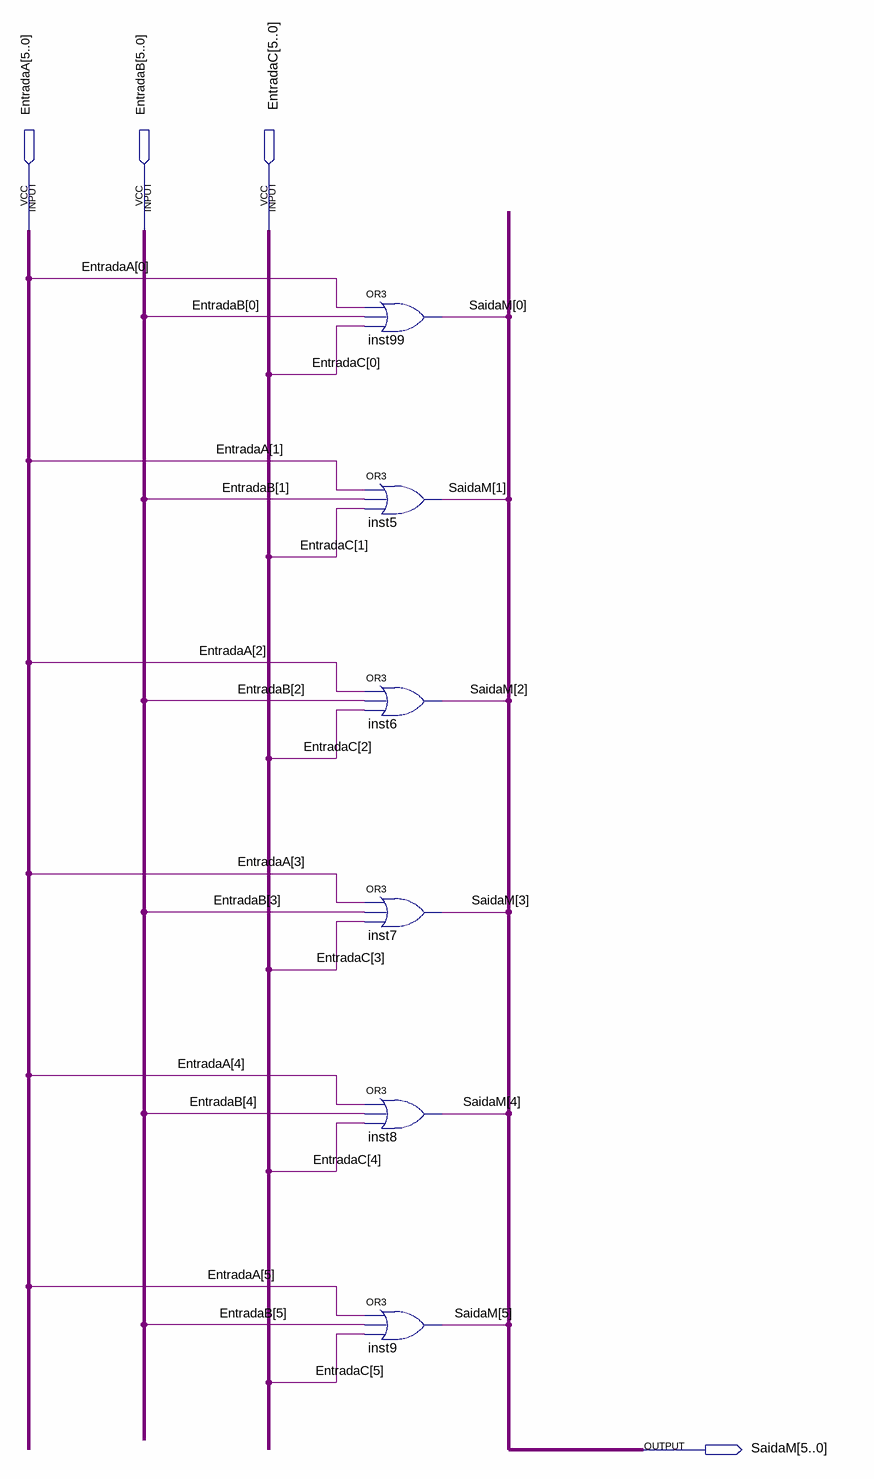
[diagram p0: schematic sheet]
// Quartus schematic Mux.bdf as structural Verilog: 6 symbols, 4 pins
module Mux (
  input  [5:0] EntradaA,
  input  [5:0] EntradaB,
  input  [5:0] EntradaC,
  output [5:0] SaidaM
);

  or inst99 (SaidaM[0], EntradaA[0], EntradaB[0], EntradaC[0]);
  or inst5 (SaidaM[1], EntradaA[1], EntradaB[1], EntradaC[1]);
  or inst6 (SaidaM[2], EntradaA[2], EntradaB[2], EntradaC[2]);
  or inst7 (SaidaM[3], EntradaA[3], EntradaB[3], EntradaC[3]);
  or inst8 (SaidaM[4], EntradaA[4], EntradaB[4], EntradaC[4]);
  or inst9 (SaidaM[5], EntradaA[5], EntradaB[5], EntradaC[5]);
endmodule
